# Altium schematic sheet Main.SchDoc: Main
size A4; CompanyName: -; DrawnBy: Naldi, López; Revision: 1; SheetNumber: 1; SheetTotal: 4; Number: 25
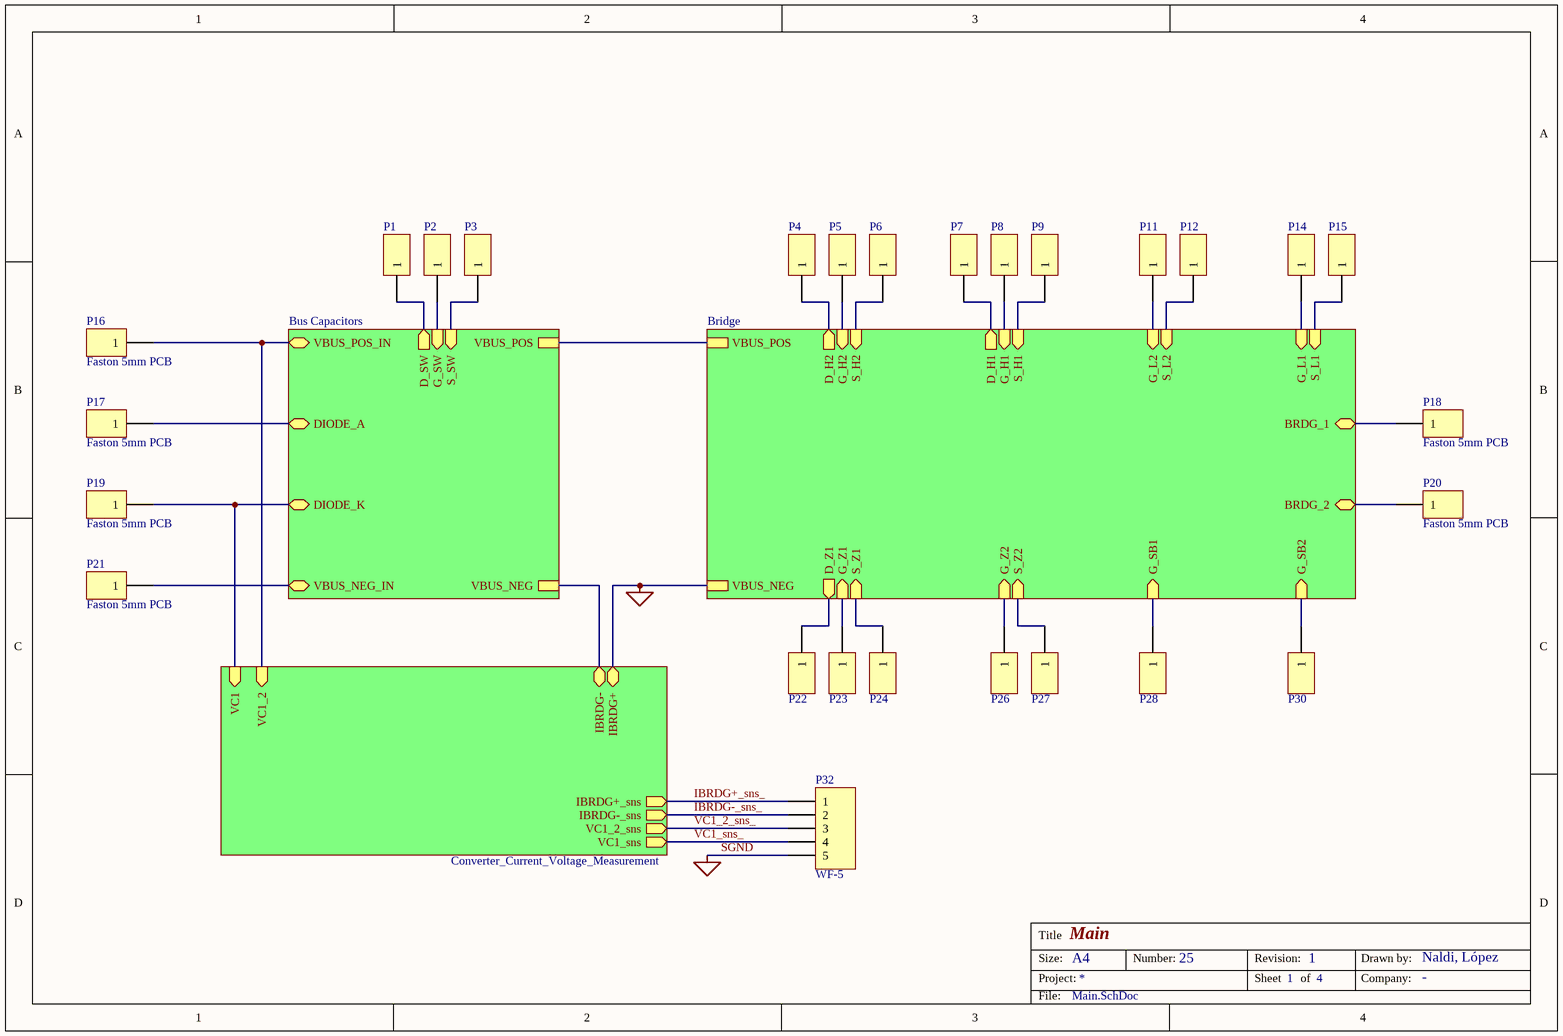
[diagram p0: Main.SchDoc]

## Parts
P1  TS-101-T-AA  [SAMTEC TERMINAL/SOCKET STRIP 1 PIN new]  (value not drawn)
P2  TS-101-T-AA  [SAMTEC TERMINAL/SOCKET STRIP 1 PIN new]  (value not drawn)
P3  TS-101-T-AA  [SAMTEC TERMINAL/SOCKET STRIP 1 PIN new]  (value not drawn)
P4  TS-101-T-AA  [SAMTEC TERMINAL/SOCKET STRIP 1 PIN new]  (value not drawn)
P5  TS-101-T-AA  [SAMTEC TERMINAL/SOCKET STRIP 1 PIN new]  (value not drawn)
P6  TS-101-T-AA  [SAMTEC TERMINAL/SOCKET STRIP 1 PIN new]  (value not drawn)
P7  TS-101-T-AA  [SAMTEC TERMINAL/SOCKET STRIP 1 PIN new]  (value not drawn)
P8  TS-101-T-AA  [SAMTEC TERMINAL/SOCKET STRIP 1 PIN new]  (value not drawn)
P9  TS-101-T-AA  [SAMTEC TERMINAL/SOCKET STRIP 1 PIN new]  (value not drawn)
P11  TS-101-T-AA  [SAMTEC TERMINAL/SOCKET STRIP 1 PIN new]  (value not drawn)
P12  TS-101-T-AA  [SAMTEC TERMINAL/SOCKET STRIP 1 PIN new]  (value not drawn)
P14  TS-101-T-AA  [SAMTEC TERMINAL/SOCKET STRIP 1 PIN new]  (value not drawn)
P15  TS-101-T-AA  [SAMTEC TERMINAL/SOCKET STRIP 1 PIN new]  (value not drawn)
P16  Faston 5mm PCB  [FASTON 5mm PCB]
P17  Faston 5mm PCB  [FASTON 5mm PCB]
P18  Faston 5mm PCB  [FASTON 5mm PCB]
P19  Faston 5mm PCB  [FASTON 5mm PCB]
P20  Faston 5mm PCB  [FASTON 5mm PCB]
P21  Faston 5mm PCB  [FASTON 5mm PCB]
P22  TS-101-T-AA  [SAMTEC TERMINAL/SOCKET STRIP 1 PIN new]  (value not drawn)
P23  TS-101-T-AA  [SAMTEC TERMINAL/SOCKET STRIP 1 PIN new]  (value not drawn)
P24  TS-101-T-AA  [SAMTEC TERMINAL/SOCKET STRIP 1 PIN new]  (value not drawn)
P26  TS-101-T-AA  [SAMTEC TERMINAL/SOCKET STRIP 1 PIN new]  (value not drawn)
P27  TS-101-T-AA  [SAMTEC TERMINAL/SOCKET STRIP 1 PIN new]  (value not drawn)
P28  TS-101-T-AA  [SAMTEC TERMINAL/SOCKET STRIP 1 PIN new]  (value not drawn)
P30  TS-101-T-AA  [SAMTEC TERMINAL/SOCKET STRIP 1 PIN new]  (value not drawn)
P32  WF-5  [HDR1X5]

## Sub-sheets
Bridge = Bridge.SchDoc: BRDG_2 (bidir), BRDG_1 (bidir), VBUS_POS, VBUS_NEG, G_H2 (in), S_H2 (in), G_H1 (in), S_H1 (in), G_L2 (in), S_L2 (in), G_SB1 (in), G_SB2 (in), G_Z2 (in), S_Z2 (in), G_Z1 (in), S_Z1 (in), G_L1 (in), S_L1 (in), D_H2 (out), D_H1 (out), D_Z1 (out)
Bus Capacitors = Bus_Capacitors.SchDoc: VBUS_NEG, VBUS_POS, VBUS_POS_IN (bidir), DIODE_A (bidir), DIODE_K (bidir), VBUS_NEG_IN (bidir), G_SW (in), S_SW (in), D_SW (out)
Converter_Current_Voltage_Measurement = Converter_Current_Voltage_Measurement.SchDoc: VC1 (in), VC1_sns (out), IBRDG+_sns (out), VC1_2 (in), IBRDG- (bidir), IBRDG+ (bidir), VC1_2_sns (out), IBRDG-_sns (out)

## Nets
SGND: P32.5 ; sheet Converter_Current_Voltage_Measurement/IBRDG+, sheet Bridge/VBUS_NEG
IBRDG+_sns_: P32.1 ; sheet Converter_Current_Voltage_Measurement/IBRDG+_sns
IBRDG-_sns_: P32.2 ; sheet Converter_Current_Voltage_Measurement/IBRDG-_sns
VC1_2_sns_: P32.3 ; sheet Converter_Current_Voltage_Measurement/VC1_2_sns
VC1_sns_: P32.4 ; sheet Converter_Current_Voltage_Measurement/VC1_sns
NetP1_1: P1.1 ; sheet Bus Capacitors/D_SW
NetP2_1: P2.1 ; sheet Bus Capacitors/G_SW
NetP3_1: P3.1 ; sheet Bus Capacitors/S_SW
NetP4_1: P4.1 ; sheet Bridge/D_H2
NetP5_1: P5.1 ; sheet Bridge/G_H2
NetP6_1: P6.1 ; sheet Bridge/S_H2
NetP7_1: P7.1 ; sheet Bridge/D_H1
NetP8_1: P8.1 ; sheet Bridge/G_H1
NetP9_1: P9.1 ; sheet Bridge/S_H1
NetP11_1: P11.1 ; sheet Bridge/G_L2
NetP12_1: P12.1 ; sheet Bridge/S_L2
NetP14_1: P14.1 ; sheet Bridge/G_L1
NetP15_1: P15.1 ; sheet Bridge/S_L1
NetP16_1: P16.1 ; sheet Bus Capacitors/VBUS_POS_IN, sheet Converter_Current_Voltage_Measurement/VC1_2
NetP17_1: P17.1 ; sheet Bus Capacitors/DIODE_A
NetP18_1: P18.1 ; sheet Bridge/BRDG_1
NetP19_1: P19.1 ; sheet Bus Capacitors/DIODE_K, sheet Converter_Current_Voltage_Measurement/VC1
NetP20_1: P20.1 ; sheet Bridge/BRDG_2
NetP21_1: P21.1 ; sheet Bus Capacitors/VBUS_NEG_IN
NetP22_1: P22.1 ; sheet Bridge/D_Z1
NetP23_1: P23.1 ; sheet Bridge/G_Z1
NetP24_1: P24.1 ; sheet Bridge/S_Z1
NetP26_1: P26.1 ; sheet Bridge/G_Z2
NetP27_1: P27.1 ; sheet Bridge/S_Z2
NetP28_1: P28.1 ; sheet Bridge/G_SB1
NetP30_1: P30.1 ; sheet Bridge/G_SB2
(unnamed): sheet Bus Capacitors/VBUS_NEG, sheet Converter_Current_Voltage_Measurement/IBRDG-
(unnamed): sheet Bus Capacitors/VBUS_POS, sheet Bridge/VBUS_POS

## Notes on the sheet
- Title
- Size:
- Project:
- A4
- Number:
- Revision:
- Sheet
- of
- Drawn by:
- Company:
- File:

## Library data of the parts
P1-P9 P11 P12 P14 P15 P22-P24 P26-P28 P30 = TS-101-T-AA: Terminal Strip, 1-Pin, 2.54mm pitch; System: Connector; LatestRevisionDate: 17-Jul-2002; LatestRevisionNote: Re-released for DXP Platform.; Publisher: Altium Limited
P16-P21 = Faston 5mm PCB: System: Connector; LatestRevisionDate: 17-Jul-2002; LatestRevisionNote: Re-released for DXP Platform.; Publisher: Altium Limited
P32 = Header 5: Header, 5-Pin, 2.54mm pitch; System: Connector; LatestRevisionDate: 17-Jul-2002; LatestRevisionNote: Re-released for DXP Platform.; Publisher: Altium Limited